# EAGLE schematic ElectroLab (EAGLE 9.5.1)

## Sheet 1 of 4
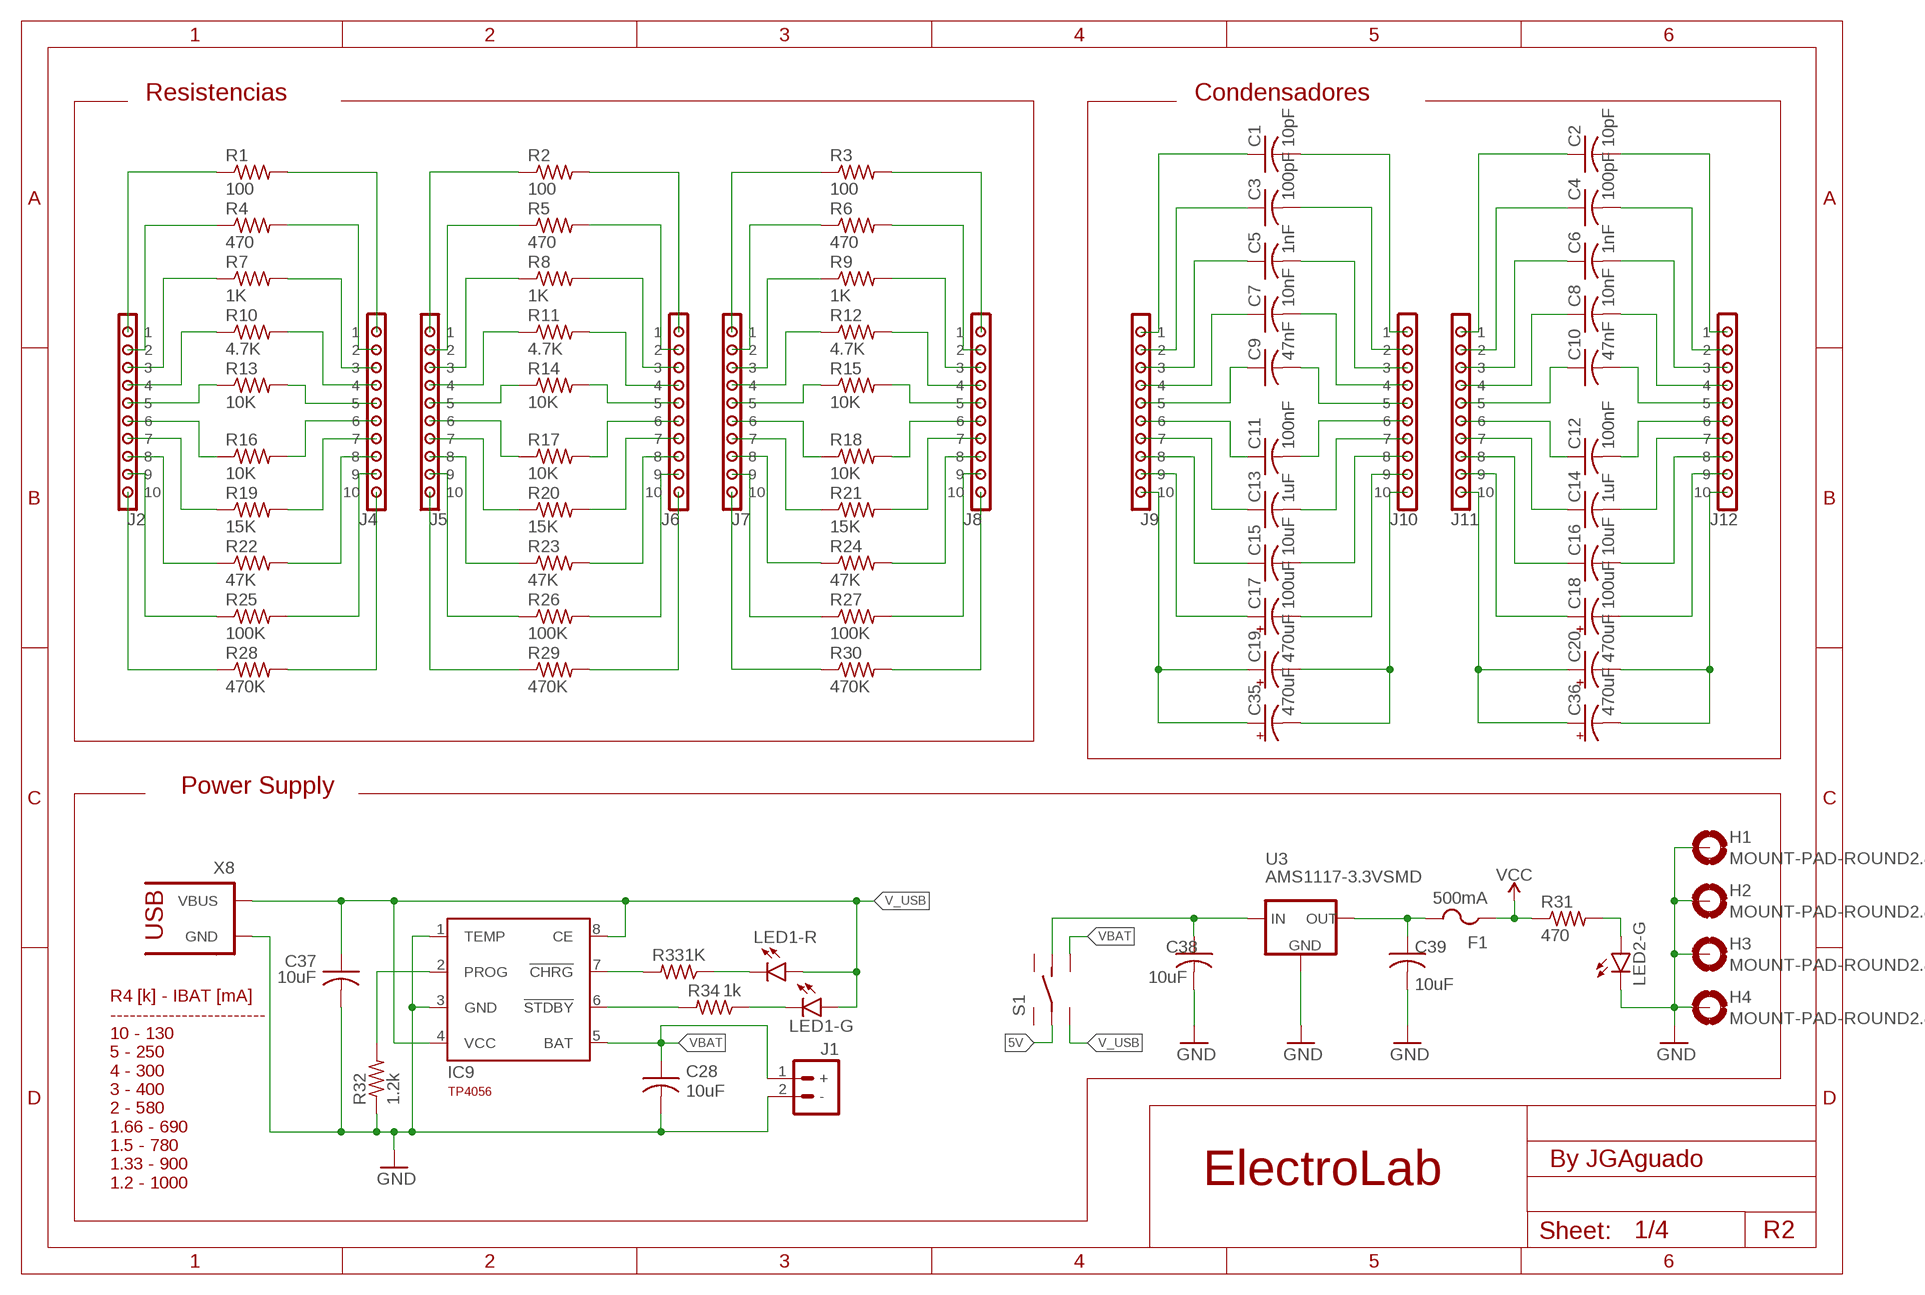
[diagram p0: schematic, sheet 1]

### Parts
C1  10pF  C0603  [0603]
C2  10pF  C0603  [0603]
C3  100pF  C0603  [0603]
C4  100pF  C0603  [0603]
C5  1nF  C0603  [0603]
C6  1nF  C0603  [0603]
C7  10nF  C0603  [0603]
C8  10nF  C0603  [0603]
C9  47nF  C0603  [0603]
C10  47nF  C0603  [0603]
C11  100nF  C0603  [0603]
C12  100nF  C0603  [0603]
C13  1uF  C0603  [0603]
C14  1uF  C0603  [0603]
C15  10uF  C0603  [0603]
C16  10uF  C0603  [0603]
C17  100uF  C3528  [B/3528-21R]
C18  100uF  C3528  [B/3528-21R]
C19  470uF  C7343  [D/7343-31R]
C20  470uF  C7343  [D/7343-31R]
C28  10uF  C-USC0603  [C0603]
C35  470uF  C7343  [D/7343-31R]
C36  470uF  C7343  [D/7343-31R]
C37  10uF  C-USC0603  [C0603]
C38  10uF  C-USC0603  [C0603]
C39  10uF  C-USC0603  [C0603]
F1  500mA  PTCFUSE-1206  [R1206]
H1  MOUNT-PAD-ROUND2.8  [2,8-PAD]
H2  MOUNT-PAD-ROUND2.8  [2,8-PAD]
H3  MOUNT-PAD-ROUND2.8  [2,8-PAD]
H4  MOUNT-PAD-ROUND2.8  [2,8-PAD]
IC9  TP4056  [SOT23-8]
J1  BAT_CONN-JST-2MM-SMT  [JST-2-SMD]
J2  CONN_10"  [1X10]
J4  CONN_10"  [1X10]
J5  CONN_10"  [1X10]
J6  CONN_10"  [1X10]
J7  CONN_10"  [1X10]
J8  CONN_10"  [1X10]
J9  CONN_10"  [1X10]
J10  CONN_10"  [1X10]
J11  CONN_10"  [1X10]
J12  CONN_10"  [1X10]
LED1  E6CC1205RYGC2UDA  RED&GREEN_LED  [BICOLOR_LED]
LED2  E6CC1205RYGC2UDA  RED&GREEN_LED  [BICOLOR_LED]
R1  100  R0603  [0603]
R2  100  R0603  [0603]
R3  100  R0603  [0603]
R4  470  R0603  [0603]
R5  470  R0603  [0603]
R6  470  R0603  [0603]
R7  1K  R0603  [0603]
R8  1K  R0603  [0603]
R9  1K  R0603  [0603]
R10  4.7K  R0603  [0603]
R11  4.7K  R0603  [0603]
R12  4.7K  R0603  [0603]
R13  10K  R0603  [0603]
R14  10K  R0603  [0603]
R15  10K  R0603  [0603]
R16  10K  R0603  [0603]
R17  10K  R0603  [0603]
R18  10K  R0603  [0603]
R19  15K  R0603  [0603]
R20  15K  R0603  [0603]
R21  15K  R0603  [0603]
R22  47K  R0603  [0603]
R23  47K  R0603  [0603]
R24  47K  R0603  [0603]
R25  100K  R0603  [0603]
R26  100K  R0603  [0603]
R27  100K  R0603  [0603]
R28  470K  R0603  [0603]
R29  470K  R0603  [0603]
R30  470K  R0603  [0603]
R31  470  R0603  [0603]
R32  1.2k  R-US_R0603  [R0603]
R33  1K  R0603  [0603]
R34  1k  R0603  [0603]
S1  DPDT_JS202011CQN  [DPDT_JS202011CQN]
U3  AMS1117-3.3VSMD  [SOT223]
X8  USB-C-POWER  [USB-C-POWER]

### Nets
5V: S1.2(LC) ; also sheet 3
GND: C28.2 C37.2 C38.2 C39.2 H1.B2,8(MOUNT) H2.B2,8(MOUNT) H3.B2,8(MOUNT) H4.B2,8(MOUNT) IC9.1(TEMP) IC9.3(GND) J1.2(-) LED2.1(-G:C) R32.1 U3.1(GND) X8.GND ; also sheet 2,3,4
N$1: J2.1 R1.1
N$2: J2.2 R4.1
N$3: J2.3 R7.1
N$4: J2.4 R10.1
N$5: J2.5 R13.1
N$6: J2.6 R16.1
N$7: J2.7 R19.1
N$8: J2.8 R22.1
N$9: J2.9 R25.1
N$10: J2.10 R28.1
N$11: J4.10 R28.2
N$12: J4.9 R25.2
N$13: J4.8 R22.2
N$14: J4.7 R19.2
N$15: J4.5 R13.2
N$16: J4.6 R16.2
N$17: J4.4 R10.2
N$18: J4.3 R7.2
N$19: J4.2 R4.2
N$20: J4.1 R1.2
N$21: J5.1 R2.1
N$22: J5.2 R5.1
N$23: J5.3 R8.1
N$24: J5.4 R11.1
N$25: J5.5 R14.1
N$26: J5.6 R17.1
N$27: J5.7 R20.1
N$28: J5.8 R23.1
N$29: J5.9 R26.1
N$30: J5.10 R29.1
N$31: J6.10 R29.2
N$32: J6.9 R26.2
N$33: J6.8 R23.2
N$34: J6.7 R20.2
N$35: J6.6 R17.2
N$36: J6.5 R14.2
N$37: J6.4 R11.2
N$38: J6.3 R8.2
N$39: J6.2 R5.2
N$40: J6.1 R2.2
N$41: J7.1 R3.1
N$42: J7.2 R6.1
N$43: J7.3 R9.1
N$44: J7.4 R12.1
N$45: J7.5 R15.1
N$46: J7.6 R18.1
N$47: J7.7 R21.1
N$48: J7.8 R24.1
N$49: J7.9 R27.1
N$50: J7.10 R30.1
N$51: J8.10 R30.2
N$52: J8.9 R27.2
N$53: J8.8 R24.2
N$54: J8.7 R21.2
N$55: J8.6 R18.2
N$56: J8.5 R15.2
N$57: J8.4 R12.2
N$58: J8.3 R9.2
N$59: J8.2 R6.2
N$60: J8.1 R3.2
N$61: C1.1 J9.1
N$62: C3.1 J9.2
N$63: C5.1 J9.3
N$64: C7.1 J9.4
N$65: C9.1 J9.5
N$66: C11.1 J9.6
N$67: C13.1 J9.7
N$68: C15.1 J9.8
N$69: C17.+ J9.9
N$70: C19.+ C35.+ J9.10
N$71: C1.2 J10.1
N$72: C3.2 J10.2
N$73: C5.2 J10.3
N$74: C7.2 J10.4
N$75: C9.2 J10.5
N$76: C11.2 J10.6
N$77: C13.2 J10.7
N$78: C15.2 J10.8
N$79: C17.- J10.9
N$80: C19.- C35.- J10.10
N$81: C2.1 J11.1
N$82: C4.1 J11.2
N$83: C6.1 J11.3
N$84: C8.1 J11.4
N$85: C10.1 J11.5
N$86: C12.1 J11.6
N$87: C14.1 J11.7
N$88: C16.1 J11.8
N$89: C18.+ J11.9
N$90: C20.+ C36.+ J11.10
N$91: C20.- C36.- J12.10
N$92: C18.- J12.9
N$93: C16.2 J12.8
N$94: C14.2 J12.7
N$95: C12.2 J12.6
N$96: C10.2 J12.5
N$97: C8.2 J12.4
N$98: C6.2 J12.3
N$99: C4.2 J12.2
N$100: C2.2 J12.1
N$103: LED2.2(-G:A) R31.2
N$104: IC9.6(!STDBY) R34.2
N$105: LED1.4(-R:C) R33.1
N$106: LED1.1(-G:C) R34.1
N$107: IC9.2(PROG) R32.2
N$108: IC9.7(!CHRG) R33.2
N$109: C38.1 S1.5(RC) U3.3(IN)
V_USB: C37.1 IC9.4(VCC) IC9.8(CE) LED1.2(-G:A) LED1.3(-R:A) S1.3(L2) X8.VBUS
VBAT: C28.1 IC9.5(BAT) J1.1(+) S1.6(R2)
VCC: F1.1 R31.1 ; also sheet 2,3,4
VOUT: C39.1 F1.2 U3.2(OUT)
Unconnected: LED2.3(-R:A) LED2.4(-R:C) S1.1(L1) S1.4(R1)

### Notes on the sheet
- Resistencias | Condensadores
- Power Supply
- R4 [k] - IBAT [mA]
  ------------------------
  10 - 130
  5 - 250
  4 - 300
  3 - 400
  2 - 580
  1.66 - 690
  1.5 - 780
  1.33 - 900
  1.2 - 1000
- By JGAguado
- R2

## Sheet 2 of 4
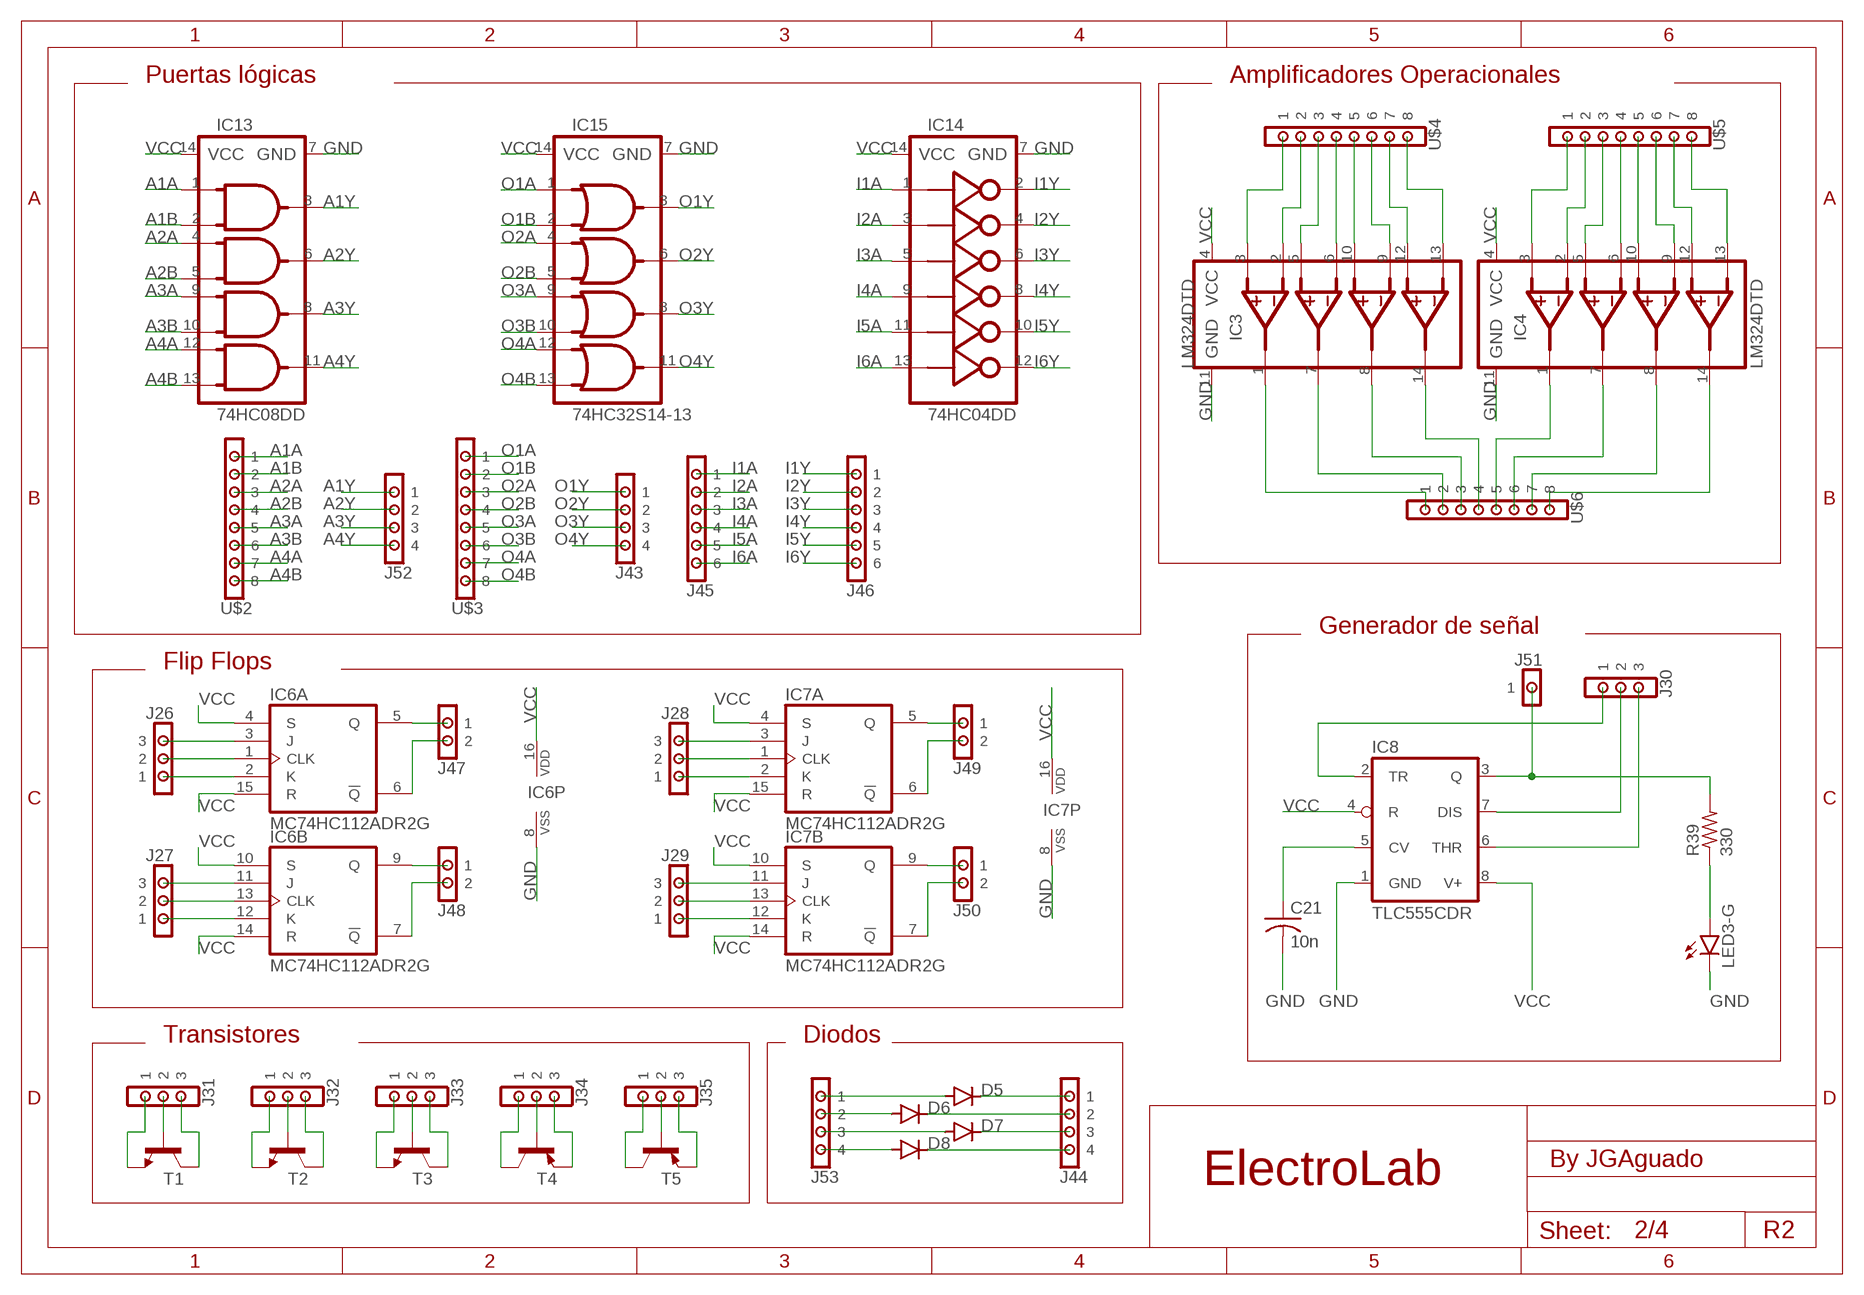
[diagram p1: schematic, sheet 2]

### Parts
C21  10n  C0603  [0603]
D5  LL4148  [LL-34]
D6  LL4148  [LL-34]
D7  LL4148  [LL-34]
D8  LL4148  [LL-34]
IC3  LM324DTD  [SO14]
IC4  LM324DTD  [SO14]
IC6  MC74HC112ADR2G  JK_FLIP_FLOPMC74HC112ADR2G  [SO16]
IC7  MC74HC112ADR2G  JK_FLIP_FLOPMC74HC112ADR2G  [SO16]
IC8  TLC555CDR  NE555D  [SO08]
IC13  74HC08DD  [SO14]
IC14  74HC04DD  [SO14]
IC15  74HC32S14-13  74AHC32D74HC32S14-13  [SO14]
J26  CONN_03  [1X03]
J27  CONN_03  [1X03]
J28  CONN_03  [1X03]
J29  CONN_03  [1X03]
J30  CONN_03  [1X03]
J31  CONN_03  [1X03]
J32  CONN_03  [1X03]
J33  CONN_03  [1X03]
J34  CONN_03  [1X03]
J35  CONN_03  [1X03]
J43  CONN_04  [1X04]
J44  CONN_04  [1X04]
J45  CONN_06  [1X06]
J46  CONN_06  [1X06]
J47  CONN_02  [1X02]
J48  CONN_02  [1X02]
J49  CONN_02  [1X02]
J50  CONN_02  [1X02]
J51  CONN_01  [1X01]
J52  CONN_04  [1X04]
J53  CONN_04  [1X04]
LED3  E6CC1205RYGC2UDA  RED&GREEN_LED  [BICOLOR_LED]
R39  330  R0603  [0603]
T1  MMBT2222A  T_NPNMMBT2222A-1P_CHANGJ_SOT23-BEC  [SOT23]
T2  T_NPNMMBT2222A-1P_CHANGJ_SOT23-BEC  [SOT23]
T3  T_NPNMMBT2222A-1P_CHANGJ_SOT23-BEC  [SOT23]
T4  T_PNPMMBT5401_CHANGJ_SOT23-BEC  [SOT23]
T5  T_PNPMMBT5401_CHANGJ_SOT23-BEC  [SOT23]
U$2  CONN_08  [1X08]
U$3  CONN_08  [1X08]
U$4  CONN_08  [1X08]
U$5  CONN_08  [1X08]
U$6  CONN_08  [1X08]

### Nets
A1A: IC13.1(1A) U$2.1 ; also sheet 4
A1B: IC13.2(1B) U$2.2 ; also sheet 4
A1Y: IC13.3(1Y) J52.1
A2A: IC13.4(2A) U$2.3 ; also sheet 4
A2B: IC13.5(2B) U$2.4 ; also sheet 4
A2Y: IC13.6(2Y) J52.2
A3A: IC13.9(3A) U$2.5 ; also sheet 4
A3B: IC13.10(3B) U$2.6 ; also sheet 4
A3Y: IC13.8(3Y) J52.3
A4A: IC13.12(4A) U$2.7 ; also sheet 4
A4B: IC13.13(4B) U$2.8 ; also sheet 4
A4Y: IC13.11(4Y) J52.4
GND: C21.2 IC3.11(GND) IC4.11(GND) IC6.8(P:VSS) IC7.8(P:VSS) IC8.1(GND) IC13.7(GND) IC14.7(GND) IC15.7(GND) LED3.1(-G:C) ; also sheet 1,3,4
I1A: IC14.1(1A) J45.1 ; also sheet 4
I1Y: IC14.2(1Y) J46.1
I2A: IC14.3(2A) J45.2 ; also sheet 4
I2Y: IC14.4(2Y) J46.2
I3A: IC14.5(3A) J45.3 ; also sheet 4
I3Y: IC14.6(3Y) J46.3
I4A: IC14.9(4A) J45.4 ; also sheet 4
I4Y: IC14.8(4Y) J46.4
I5A: IC14.11(5A) J45.5 ; also sheet 4
I5Y: IC14.10(5Y) J46.5
I6A: IC14.13(6A) J45.6 ; also sheet 4
I6Y: IC14.12(6Y) J46.6
N$101: D8.A J53.4
N$110: D8.C J44.4
N$111: D5.A J53.1
N$112: IC6.5(A:Q) J47.1
N$113: IC6.9(B:Q) J48.1
N$114: IC7.5(A:Q) J49.1
N$115: IC7.9(B:Q) J50.1
N$122: LED3.2(-G:A) R39.1
N$130: IC3.3(1+) U$4.1
N$131: IC3.2(1-) U$4.2
N$132: IC3.5(2+) U$4.3
N$133: IC3.6(2-) U$4.4
N$134: IC3.10(3+) U$4.5
N$135: IC3.9(3-) U$4.6
N$136: IC3.12(4+) U$4.7
N$137: IC3.13(4-) U$4.8
N$138: IC4.3(1+) U$5.1
N$146: IC6.2(A:K) J26.1
N$155: IC6.1(A:CLK) J26.2
N$156: IC6.3(A:J) J26.3
N$157: IC6.12(B:K) J27.1
N$158: IC6.13(B:CLK) J27.2
N$159: IC6.11(B:J) J27.3
N$160: IC7.2(A:K) J28.1
N$161: IC7.1(A:CLK) J28.2
N$162: IC7.3(A:J) J28.3
N$171: IC7.12(B:K) J29.1
N$172: IC7.13(B:CLK) J29.2
N$173: IC7.11(B:J) J29.3
N$178: IC6.6(A:!Q) J47.2
N$179: IC6.7(B:!Q) J48.2
N$180: IC7.6(A:!Q) J49.2
N$181: IC7.7(B:!Q) J50.2
N$183: D7.A J53.3
N$184: D6.A J53.2
N$186: IC4.2(1-) U$5.2
N$187: IC4.5(2+) U$5.3
N$188: IC4.6(2-) U$5.4
N$189: IC4.10(3+) U$5.5
N$190: IC4.9(3-) U$5.6
N$191: IC4.12(4+) U$5.7
N$192: IC4.13(4-) U$5.8
N$193: IC3.1(1Y) U$6.1
N$194: IC3.7(2Y) U$6.2
N$195: IC3.8(3Y) U$6.3
N$196: IC3.14(4Y) U$6.4
N$197: IC4.1(1Y) U$6.5
N$198: IC4.7(2Y) U$6.6
N$199: D5.C J44.1
N$200: IC4.8(3Y) U$6.7
N$201: IC4.14(4Y) U$6.8
N$202: D6.C J44.2
N$203: D7.C J44.3
N$205: J31.1 T1.2(E)
N$206: J31.2 T1.1(B)
N$207: J31.3 T1.3(C)
N$208: J32.1 T2.2(E)
N$209: J32.2 T2.1(B)
N$210: J32.3 T2.3(C)
N$211: J33.1 T3.2(E)
N$212: J33.2 T3.1(B)
N$213: J33.3 T3.3(C)
N$217: J34.1 T4.3(C)
N$218: J34.2 T4.1(B)
N$219: J34.3 T4.2(E)
N$220: J35.1 T5.3(C)
N$221: J35.2 T5.1(B)
N$222: J35.3 T5.2(E)
N$223: IC8.2(TR) J30.1
N$224: IC8.3(Q) J51.1 R39.2
N$225: C21.1 IC8.5(CV)
N$226: IC8.7(DIS) J30.2
N$227: IC8.6(THR) J30.3
O1A: IC15.1(1A) U$3.1 ; also sheet 4
O1B: IC15.2(1B) U$3.2 ; also sheet 4
O1Y: IC15.3(1Y) J43.1
O2A: IC15.4(2A) U$3.3 ; also sheet 4
O2B: IC15.5(2B) U$3.4 ; also sheet 4
O2Y: IC15.6(2Y) J43.2
O3A: IC15.9(3A) U$3.5 ; also sheet 4
O3B: IC15.10(3B) U$3.6 ; also sheet 4
O3Y: IC15.8(3Y) J43.3
O4A: IC15.12(4A) U$3.7 ; also sheet 4
O4B: IC15.13(4B) U$3.8 ; also sheet 4
O4Y: IC15.11(4Y) J43.4
VCC: IC3.4(VCC) IC4.4(VCC) IC6.4(A:S) IC6.10(B:S) IC6.14(B:R) IC6.15(A:R) IC6.16(P:VDD) IC7.4(A:S) IC7.10(B:S) IC7.14(B:R) IC7.15(A:R) IC7.16(P:VDD) IC8.4(R) IC8.8(V+) IC13.14(VCC) IC14.14(VCC) IC15.14(VCC) ; also sheet 1,3,4
Unconnected: LED3.3(-R:A) LED3.4(-R:C)

### Notes on the sheet
- Puertas lógicas | Amplificadores Operacionales
- Generador de señal
- Flip Flops
- Transistores | Diodos
- By JGAguado
- R2

## Sheet 3 of 4
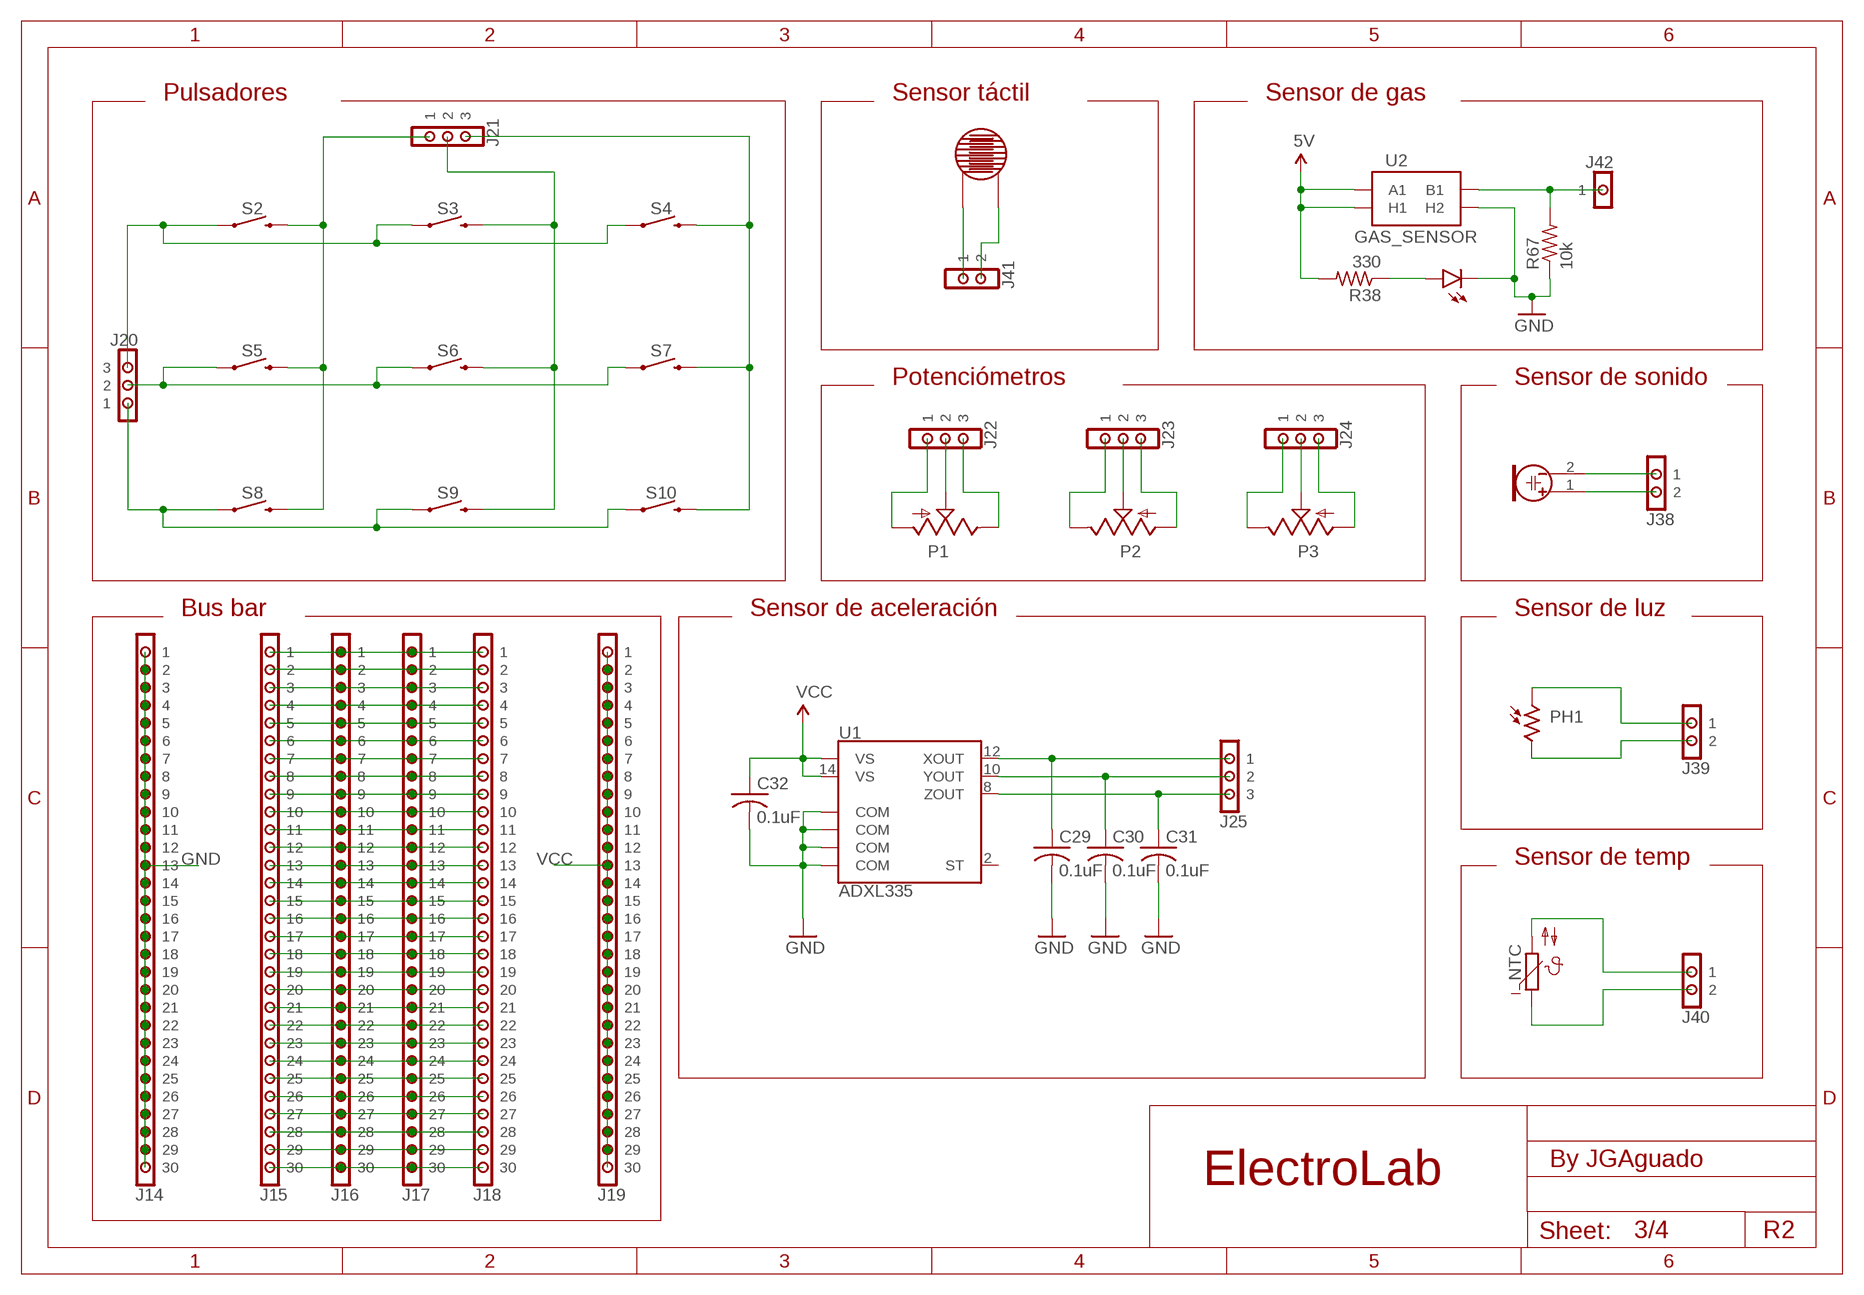
[diagram p2: schematic, sheet 3]

### Parts
C29  0.1uF  C0603  [0603]
C30  0.1uF  C0603  [0603]
C31  0.1uF  C0603  [0603]
C32  0.1uF  C0603  [0603]
J14  CONN_30  [1X30]
J15  CONN_30  [1X30]
J16  CONN_30  [1X30]
J17  CONN_30  [1X30]
J18  CONN_30  [1X30]
J19  CONN_30  [1X30]
J20  CONN_03  [1X03]
J21  CONN_03  [1X03]
J22  CONN_03  [1X03]
J23  CONN_03  [1X03]
J24  CONN_03  [1X03]
J25  CONN_03  [1X03]
J38  CONN_02  [1X02]
J39  CONN_02  [1X02]
J40  CONN_02  [1X02]
J41  CONN_02  [1X02]
J42  CONN_01  [1X01]
LED13  E6CC1205RYGC2UDA  RED&GREEN_LED  [BICOLOR_LED]
MIC  MICROPHONE  [MICROPHONE]
NTC  THERMISTOR  [NTC]
P1  SLIDE_POT_20MM  [RS201111J011]
P2  ALPS_RK09K_VERTICAL  [ALPS_RK09K_VERTICAL]
P3  ALPS_RK09K_VERTICAL  [ALPS_RK09K_VERTICAL]
PH1  PHOTORESISTOR  [GL5516]
R38  330  R0603  [0603]
R67  10k  R0603  [0603]
S2  MOMENTARY-SWITCH-SPST-PTH-6.0MM  [TACTILE_SWITCH_PTH_6.0MM]
S3  MOMENTARY-SWITCH-SPST-PTH-6.0MM  [TACTILE_SWITCH_PTH_6.0MM]
S4  MOMENTARY-SWITCH-SPST-PTH-6.0MM  [TACTILE_SWITCH_PTH_6.0MM]
S5  MOMENTARY-SWITCH-SPST-PTH-6.0MM  [TACTILE_SWITCH_PTH_6.0MM]
S6  MOMENTARY-SWITCH-SPST-PTH-6.0MM  [TACTILE_SWITCH_PTH_6.0MM]
S7  MOMENTARY-SWITCH-SPST-PTH-6.0MM  [TACTILE_SWITCH_PTH_6.0MM]
S8  MOMENTARY-SWITCH-SPST-PTH-6.0MM  [TACTILE_SWITCH_PTH_6.0MM]
S9  MOMENTARY-SWITCH-SPST-PTH-6.0MM  [TACTILE_SWITCH_PTH_6.0MM]
S10  MOMENTARY-SWITCH-SPST-PTH-6.0MM  [TACTILE_SWITCH_PTH_6.0MM]
U1  ADXL335  [LFCSP-16-4X4]
U2  GAS_SENSOR  GAS_SENSORMQ-3  [GAS_SENSOR]
U$16  RESISTIVE_SENSOR_PAD  [RESISTIVE_SENSOR_PAD]

### Nets
5V: R38.2 U2.A1 U2.HA(H1) ; also sheet 1
GND: C29.2 C30.2 C31.2 C32.2 J14.1 J14.2 J14.3 J14.4 J14.5 J14.6 J14.7 J14.8 J14.9 J14.10 J14.11 J14.12 J14.13 J14.14 J14.15 J14.16 J14.17 J14.18 J14.19 J14.20 J14.21 J14.22 J14.23 J14.24 J14.25 J14.26 J14.27 J14.28 J14.29 J14.30 LED13.1(-G:C) R67.1 U1.3(COM) U1.5(COM) U1.6(COM) U1.7(COM) U2.HB(H2) ; also sheet 1,2,4
N$119: J42.1 R67.2 U2.B1
N$120: LED13.2(-G:A) R38.1
N$125: J41.2 U$16.0
N$126: J41.1 U$16.1
N$127: J15.24 J16.24 J17.24 J18.24
N$128: J15.30 J16.30 J17.30 J18.30
N$129: J15.29 J16.29 J17.29 J18.29
N$139: J15.28 J16.28 J17.28 J18.28
N$140: J15.27 J16.27 J17.27 J18.27
N$141: J15.26 J16.26 J17.26 J18.26
N$142: J15.25 J16.25 J17.25 J18.25
N$143: J15.23 J16.23 J17.23 J18.23
N$144: J15.22 J16.22 J17.22 J18.22
N$145: J15.21 J16.21 J17.21 J18.21
N$147: J15.20 J16.20 J17.20 J18.20
N$148: J15.19 J16.19 J17.19 J18.19
N$149: J15.18 J16.18 J17.18 J18.18
N$150: J15.17 J16.17 J17.17 J18.17
N$151: J15.16 J16.16 J17.16 J18.16
N$152: J15.15 J16.15 J17.15 J18.15
N$153: J15.14 J16.14 J17.14 J18.14
N$154: J15.13 J16.13 J17.13 J18.13
N$163: J15.12 J16.12 J17.12 J18.12
N$164: J15.11 J16.11 J17.11 J18.11
N$165: J15.10 J16.10 J17.10 J18.10
N$166: J15.9 J16.9 J17.9 J18.9
N$167: J15.8 J16.8 J17.8 J18.8
N$168: J15.7 J16.7 J17.7 J18.7
N$169: J15.6 J16.6 J17.6 J18.6
N$170: J15.5 J16.5 J17.5 J18.5
N$174: J15.4 J16.4 J17.4 J18.4
N$175: J15.3 J16.3 J17.3 J18.3
N$176: J15.2 J16.2 J17.2 J18.2
N$177: J15.1 J16.1 J17.1 J18.1
N$231: J21.1 S2.3 S5.3 S8.3
N$232: J21.2 S3.3 S6.3 S9.3
N$234: J39.1 PH1.1
N$235: J39.2 PH1.3
N$236: J40.1 NTC.2
N$237: J23.1 P2.3
N$238: J23.2 P2.2
N$239: J23.3 P2.1
N$240: J22.1 P1.3
N$241: J22.2 P1.2
N$242: J22.3 P1.1
N$243: J24.1 P3.3
N$244: J24.2 P3.2
N$245: J24.3 P3.1
N$249: J38.1 MIC.2
N$250: J38.2 MIC.1
N$253: J20.3 S2.1 S3.1 S4.1
N$256: J40.2 NTC.1
N$258: J20.2 S5.1 S6.1 S7.1
N$260: J21.3 S4.3 S7.3 S10.3
N$261: J20.1 S8.1 S9.1 S10.1
VCC: C32.1 J19.1 J19.2 J19.3 J19.4 J19.5 J19.6 J19.7 J19.8 J19.9 J19.10 J19.11 J19.12 J19.13 J19.14 J19.15 J19.16 J19.17 J19.18 J19.19 J19.20 J19.21 J19.22 J19.23 J19.24 J19.25 J19.26 J19.27 J19.28 J19.29 J19.30 U1.14(VS) U1.15(VS) ; also sheet 1,2,4
X+: C29.1 J25.1 U1.12(XOUT)
Y+: C30.1 J25.2 U1.10(YOUT)
Z+: C31.1 J25.3 U1.8(ZOUT)
Unconnected: LED13.3(-R:A) LED13.4(-R:C) U1.2(ST)

### Notes on the sheet
- Pulsadores | Sensor táctil | Sensor de gas
- Potenciómetros | Sensor de sonido
- Bus bar | Sensor de aceleración | Sensor de luz
- Sensor de temp
- By JGAguado
- R2

## Sheet 4 of 4
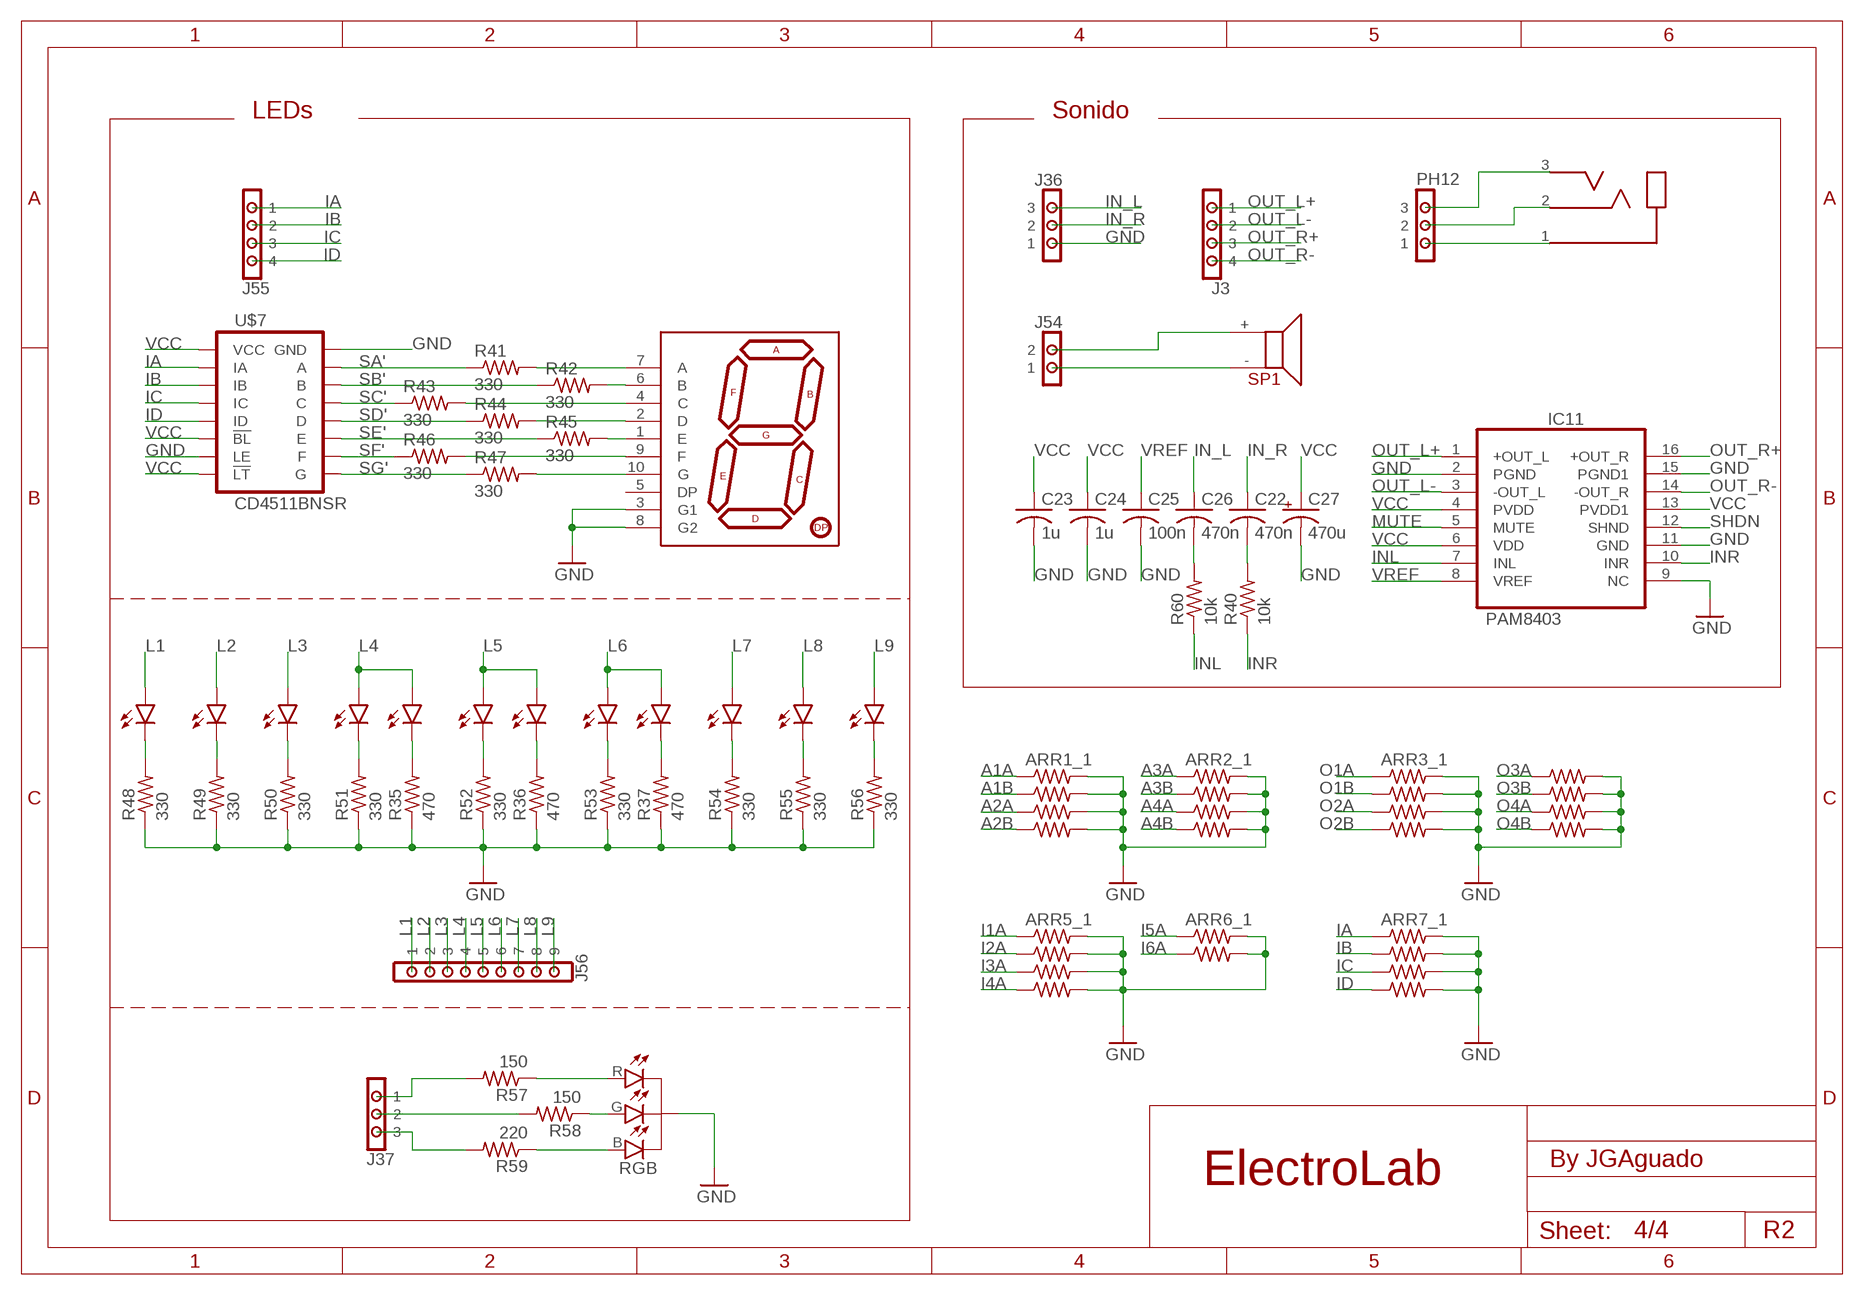
[diagram p3: schematic, sheet 4]

### Parts
ARR1  4_RES_ARRAY_R06031KOHM  [0603-ARC]
ARR2  4_RES_ARRAY_R06031KOHM  [0603-ARC]
ARR3  4_RES_ARRAY_R06031KOHM  [0603-ARC]
ARR4  4_RES_ARRAY_R06031KOHM  [0603-ARC]
ARR5  4_RES_ARRAY_R06031KOHM  [0603-ARC]
ARR6  4_RES_ARRAY_R06031KOHM  [0603-ARC]
ARR7  4_RES_ARRAY_R06031KOHM  [0603-ARC]
C22  470n  C0603  [0603]
C23  1u  C0603  [0603]
C24  1u  C0603  [0603]
C25  100n  C0603  [0603]
C26  470n  C0603  [0603]
C27  470u  C7343  [D/7343-31R]
IC11  PAM8403  [SOP-16]
J3  CONN_04  [1X04]
J36  CONN_03  [1X03]
J37  CONN_03  [1X03]
J54  CONN_02  [1X02]
J55  CONN_04  [1X04]
J56  CONN_09  [1X09]
JACK  AUDIO_JACK_MONO_3.5_3P  [HC-PJ-320A-3P-D]
LED4  E6CC1205RYGC2UDA  RED&GREEN_LED  [BICOLOR_LED]
LED5  E6CC1205RYGC2UDA  RED&GREEN_LED  [BICOLOR_LED]
LED6  E6CC1205RYGC2UDA  RED&GREEN_LED  [BICOLOR_LED]
LED7  E6CC1205RYGC2UDA  RED&GREEN_LED  [BICOLOR_LED]
LED8  E6CC1205RYGC2UDA  RED&GREEN_LED  [BICOLOR_LED]
LED9  E6CC1205RYGC2UDA  RED&GREEN_LED  [BICOLOR_LED]
LED10  E6CC1205RYGC2UDA  RED&GREEN_LED  [BICOLOR_LED]
LED11  E6CC1205RYGC2UDA  RED&GREEN_LED  [BICOLOR_LED]
LED12  E6CC1205RYGC2UDA  RED&GREEN_LED  [BICOLOR_LED]
PH12  CONN_03  [1X03]
R35  470  R0603  [0603]
R36  470  R0603  [0603]
R37  470  R0603  [0603]
R40  10k  R0603  [0603]
R41  330  R0603  [0603]
R42  330  R0603  [0603]
R43  330  R0603  [0603]
R44  330  R0603  [0603]
R45  330  R0603  [0603]
R46  330  R0603  [0603]
R47  330  R0603  [0603]
R48  330  R0603  [0603]
R49  330  R0603  [0603]
R50  330  R0603  [0603]
R51  330  R0603  [0603]
R52  330  R0603  [0603]
R53  330  R0603  [0603]
R54  330  R0603  [0603]
R55  330  R0603  [0603]
R56  330  R0603  [0603]
R57  150  R0603  [0603]
R58  150  R0603  [0603]
R59  220  R0603  [0603]
R60  10k  R0603  [0603]
RGB  CLEAR  LED-RGB-CCCLEAR  [LED-RGB-THRU]
SP1  SPEAKERFS1508MB0810-H8.0  [FS1508MB0810-H8.0]
U$1  FJ5101AG  7-SEGMENT-1DIGIT-GREEN  [7-SEGMENT]
U$7  CD4511BNSR  [SO16]

### Nets
A1A: ARR1.1 ; also sheet 2
A1B: ARR1.2 ; also sheet 2
A2A: ARR1.3 ; also sheet 2
A2B: ARR1.4 ; also sheet 2
A3A: ARR2.1 ; also sheet 2
A3B: ARR2.2 ; also sheet 2
A4A: ARR2.3 ; also sheet 2
A4B: ARR2.4 ; also sheet 2
B: J37.3 R59.2
G: J37.2 R58.2
GND: ARR1.5 ARR1.6 ARR1.7 ARR1.8 ARR2.5 ARR2.6 ARR2.7 ARR2.8 ARR3.5 ARR3.6 ARR3.7 ARR3.8 ARR4.5 ARR4.6 ARR4.7 ARR4.8 ARR5.5 ARR5.6 ARR5.7 ARR5.8 ARR6.7 ARR6.8 ARR7.5 ARR7.6 ARR7.7 ARR7.8 C23.2 C24.2 C25.2 C27.- IC11.2(PGND) IC11.9(NC) IC11.11(GND) IC11.15(PGND1) J36.1 R35.1 R36.1 R37.1 R48.1 R49.1 R50.1 R51.1 R52.1 R53.1 R54.1 R55.1 R56.1 RGB.C U$1.3(G1) U$1.8(G2) U$7.5(LE) U$7.8(GND) ; also sheet 1,2,3
I1A: ARR5.1 ; also sheet 2
I2A: ARR5.2 ; also sheet 2
I3A: ARR5.3 ; also sheet 2
I4A: ARR5.4 ; also sheet 2
I5A: ARR6.1 ; also sheet 2
I6A: ARR6.2 ; also sheet 2
IA: ARR7.1 J55.1 U$7.7(IA)
IB: ARR7.2 J55.2 U$7.1(IB)
IC: ARR7.3 J55.3 U$7.2(IC)
ID: ARR7.4 J55.4 U$7.6(ID)
IN_L: C26.1 J36.3
IN_R: C22.1 J36.2
INL: IC11.7(INL) R60.1
INR: IC11.10(INR) R40.1
L1: J56.1 LED4.2(-G:A)
L2: J56.2 LED5.2(-G:A)
L3: J56.3 LED6.2(-G:A)
L4: J56.4 LED7.2(-G:A) LED7.3(-R:A)
L5: J56.5 LED8.2(-G:A) LED8.3(-R:A)
L6: J56.6 LED9.2(-G:A) LED9.3(-R:A)
L7: J56.7 LED10.3(-R:A)
L8: J56.8 LED11.3(-R:A)
L9: J56.9 LED12.3(-R:A)
MUTE: IC11.5(MUTE)
N$102: JACK.2 PH12.2
N$116: JACK.1 PH12.1
N$117: R58.1 RGB.G
N$118: LED4.1(-G:C) R48.2
N$123: C26.2 R60.2
N$124: C22.2 R40.2
N$182: LED5.1(-G:C) R49.2
N$185: LED6.1(-G:C) R50.2
N$204: LED7.1(-G:C) R51.2
N$214: LED8.1(-G:C) R52.2
N$215: LED9.1(-G:C) R53.2
N$216: LED7.4(-R:C) R35.2
N$246: LED8.4(-R:C) R36.2
N$247: LED9.4(-R:C) R37.2
N$248: LED10.4(-R:C) R54.2
N$251: LED11.4(-R:C) R55.2
N$252: LED12.4(-R:C) R56.2
N$257: J54.2 SP1.+
N$264: JACK.3 PH12.3
N$291: J54.1 SP1.-
N$308: R57.1 RGB.R
N$310: R59.1 RGB.B
O1A: ARR3.1 ; also sheet 2
O1B: ARR3.2 ; also sheet 2
O2A: ARR3.3 ; also sheet 2
O2B: ARR3.4 ; also sheet 2
O3A: ARR4.1 ; also sheet 2
O3B: ARR4.2 ; also sheet 2
O4A: ARR4.3 ; also sheet 2
O4B: ARR4.4 ; also sheet 2
OUT_L+: IC11.1(+OUT_L) J3.1
OUT_L-: IC11.3(-OUT_L) J3.2
OUT_R+: IC11.16(+OUT_R) J3.3
OUT_R-: IC11.14(-OUT_R) J3.4
R: J37.1 R57.2
SA: R41.2 U$1.7(A)
SA': R41.1 U$7.13(A)
SB: R42.2 U$1.6(B)
SB': R42.1 U$7.12(B)
SC: R43.2 U$1.4(C)
SC': R43.1 U$7.11(C)
SD: R44.2 U$1.2(D)
SD': R44.1 U$7.10(D)
SE: R45.2 U$1.1(E)
SE': R45.1 U$7.9(E)
SF: R46.2 U$1.9(F)
SF': R46.1 U$7.15(F)
SG: R47.2 U$1.10(G)
SG': R47.1 U$7.14(G)
SHDN: IC11.12(SHND)
VCC: C23.1 C24.1 C27.+ IC11.4(PVDD) IC11.6(VDD) IC11.13(PVDD1) U$7.3(!LT) U$7.4(!BL) U$7.16(VCC) ; also sheet 1,2,3
VREF: C25.1 IC11.8(VREF)
Unconnected: ARR6.3 ARR6.4 ARR6.5 ARR6.6 LED4.3(-R:A) LED4.4(-R:C) LED5.3(-R:A) LED5.4(-R:C) LED6.3(-R:A) LED6.4(-R:C) LED10.1(-G:C) LED10.2(-G:A) LED11.1(-G:C) LED11.2(-G:A) LED12.1(-G:C) LED12.2(-G:A) U$1.5(DP)

### Notes on the sheet
- LEDs | Sonido
- By JGAguado
- R2

## Library data of the parts
ARR1-ARR7 = SpaceDIY_passive_components:4_RES_ARRAY_R0603; LCSC: C20197
C1-C16 C21-C26 C29-C32 = SpaceDIY_passive_components:C0603
C17 C18 = SpaceDIY_passive_components:C3528; LCSC: C16133
C19 C20 C27 C35 C36 = SpaceDIY_passive_components:C7343; LCSC: C7229
C28 C37-C39 = rcl:C-US: CAPACITOR, American symbol; SPICEPREFIX: C
D5-D8 = SpaceDIY_semiconductors:LL4148: Diode Ultra Fast 100V 0.2A 2SOD-80 Source: Datasheet <https://www.onsemi.com/pub/Collateral/LL4148-D.pdf>; ARROW_PART_NUMBER: LL4148; ARROW_PRICE-STOCK: https://www.arrow.com/en/products/ll4148/on-semiconductor?region=europe; DESCRIPTION: Diode Ultra Fast 100V 0.2A 2SOD-80; HEIGHT: 1mm; LCSC: C9808; MANUFACTURER_NAME: onsemi; MANUFACTURER_PART_NUMBER: LL4148; MOUSER_PART_NUMBER: 512-LL4148; MOUSER_PRICE-STOCK: https://www.mouser.co.uk/ProductDetail/ON-Semiconductor-Fairchild/LL4148?qs=z%2Fr5wmDnQfY5jXgsdLPkRg%3D%3D
F1 = adafruit:PTCFUSE: PTC fuses, resettable thermistors; LCSC: C355568
H1-H4 = holes:MOUNT-PAD-ROUND: MOUNTING PAD, round
IC3 IC4 = SpaceDIY_IC:LM324DT: Operational Amplfier; LCSC: C71035
IC6 IC7 = SpaceDIY_IC:JK_FLIP_FLOP: Dual JK FLIP FLOP; LCSC: C233600
IC8 = adafruit:*555: TIMER Changed DIP package to have round (not oval) pin pads http://www.ladyada.net/library/pcb/eaglelibrary.html; LCSC: C6986
IC9 = TP4056:TP4056: TP4056 Data sheet <http://goo.gl/J7k8TF> Dave.Calaway Eagle Library <https://goo.gl/Muy1Tr>; LCSC: C16581
IC11 = PAM8403:PAM8403: Dual channel audio amplifier IC - PAM8403
IC13 = SpaceDIY_IC:74HC08D: Logic Gates AND; LCSC: C5593
IC14 = SpaceDIY_IC:74HC04D: Hex INVERTER; LCSC: C5590
IC15 = SpaceDIY_IC:74AHC32D: Logic Gates OR; LCSC: C176921
J1 = SpaceDIY_connectors:BAT_CONN: Multi connection point. Often used as Generic Header-pin footprint for 0.1 inch spaced/style header connections On any of the 0.1 inch spaced packages, you can populate with these: Break Away Headers - Straight <https://www.sparkfun.com/products/116> (PRT-00116) Break Away Male Headers - Right Angle <https://www.sparkfun.com/products/553> (PRT-00553) Female Headers <https://www.sparkfun.com/products/115> (PRT-00115) Break Away Headers - Machine Pin <https://www.sparkfun.com/products/117> (PRT-00117) Break Away Female Headers - Swiss Machine Pin <https://www.sparkfun.com/products/743> (PRT-00743) For SCREWTERMINALS and SPRING TERMINALS visit here: Screw Terimnals on SparkFun.com <https://www.sparkfun.com/search/results?term=Screw+Terminals> (5mm/3.5mm/2.54mm spacing) This device is also useful as a general connection point to wire up your design to another part of your project. Our various solder wires solder well into these plated through hole pads. Hook-Up Wire - Assortment (Stranded, 22 AWG) <https://www.sparkfun.com/products/11375> (PRT-11375) Hook-Up Wire - Assortment (Solid Core, 22 AWG) <https://www.sparkfun.com/products/11367> (PRT-11367) View the entire wire category on our website here <https://www.sparkfun.com/categories/141> Special notes: Molex polarized connector foot print use with: PRT-08233 with associated crimp pins and housings. 2.54_SCREWTERM for use with PRT-10571. 3.5mm Screw Terminal footprints for PRT-08084 5mm Screw Terminal footprints for use with PRT-08432; LCSC: C3029440
J2 J4-J12 = SpaceDIY_connectors:CONN_10: Multi connection point. Often used as Generic Header-pin footprint for 0.1 inch spaced/style header connections On any of the 0.1 inch spaced packages, you can populate with these: Break Away Headers - Straight <https://www.sparkfun.com/products/116> (PRT-00116) Break Away Male Headers - Right Angle <https://www.sparkfun.com/products/553> (PRT-00553) Female Headers <https://www.sparkfun.com/products/115> (PRT-00115) Break Away Headers - Machine Pin <https://www.sparkfun.com/products/117> (PRT-00117) Break Away Female Headers - Swiss Machine Pin <https://www.sparkfun.com/products/743> (PRT-00743) Arduino Stackable Header - 10 Pin <https://www.sparkfun.com/products/11376> (PRT-11376) For SCREWTERMINALS and SPRING TERMINALS visit here: Screw Terimnals on SparkFun.com <https://www.sparkfun.com/search/results?term=Screw+Terminals> (5mm/3.5mm/2.54mm spacing) This device is also useful as a general connection point to wire up your design to another part of your project. Our various solder wires solder well into these plated through hole pads. Hook-Up Wire - Assortment (Stranded, 22 AWG) <https://www.sparkfun.com/products/11375> (PRT-11375) Hook-Up Wire - Assortment (Solid Core, 22 AWG) <https://www.sparkfun.com/products/11367> (PRT-11367) View the entire wire category on our website here <https://www.sparkfun.com/categories/141> Special notes: Molex polarized connector foot print use with SKU : PRT-08231 with associated crimp pins and housings. 1MM SMD Version SKU: PRT-10208 NOTES ON THE VARIANTS LOCK and LOCK_LONGPADS... This footprint was designed to help hold the alignment of a through-hole component (i.e. 6-pin header) while soldering it into place. You may notice that each hole has been shifted either up or down by 0.005 of an inch from it's more standard position (which is a perfectly straight line). This slight alteration caused the pins (the squares in the middle) to touch the edges of the holes. Because they are alternating, it causes a "brace" to hold the component in place. 0.005 has proven to be the perfect amount of "off-center" position when using our standard breakaway headers. Although looks a little odd when you look at the bare footprint, once you have a header in there, the alteration is very hard to notice. Also,if you push a header all the way into place, it is covered up entirely on the bottom side.; PROD_ID: CONN-11563
J3 J43 J44 J52 J53 J55 = SpaceDIY_connectors:CONN_04: Multi connection point. Often used as Generic Header-pin footprint for 0.1 inch spaced/style header connections On any of the 0.1 inch spaced packages, you can populate with these: Break Away Headers - Straight <https://www.sparkfun.com/products/116> (PRT-00116) Break Away Male Headers - Right Angle <https://www.sparkfun.com/products/553> (PRT-00553) Female Headers <https://www.sparkfun.com/products/115> (PRT-00115) Break Away Headers - Machine Pin <https://www.sparkfun.com/products/117> (PRT-00117) Break Away Female Headers - Swiss Machine Pin <https://www.sparkfun.com/products/743> (PRT-00743) Arduino Stackable Header - 10 Pin <https://www.sparkfun.com/products/11376> (PRT-11376) For SCREWTERMINALS and SPRING TERMINALS visit here: Screw Terimnals on SparkFun.com <https://www.sparkfun.com/search/results?term=Screw+Terminals> (5mm/3.5mm/2.54mm spacing) This device is also useful as a general connection point to wire up your design to another part of your project. Our various solder wires solder well into these plated through hole pads. Hook-Up Wire - Assortment (Stranded, 22 AWG) <https://www.sparkfun.com/products/11375> (PRT-11375) Hook-Up Wire - Assortment (Solid Core, 22 AWG) <https://www.sparkfun.com/products/11367> (PRT-11367) View the entire wire category on our website here <https://www.sparkfun.com/categories/141> Special notes: Molex polarized connector foot print use with SKU : PRT-08231 with associated crimp pins and housings. 1MM SMD Version SKU: PRT-10208 NOTES ON THE VARIANTS LOCK and LOCK_LONGPADS... This footprint was designed to help hold the alignment of a through-hole component (i.e. 6-pin header) while soldering it into place. You may notice that each hole has been shifted either up or down by 0.005 of an inch from it's more standard position (which is a perfectly straight line). This slight alteration caused the pins (the squares in the middle) to touch the edges of the holes. Because they are alternating, it causes a "brace" to hold the component in place. 0.005 has proven to be the perfect amount of "off-center" position when using our standard breakaway headers. Although looks a little odd when you look at the bare footprint, once you have a header in there, the alteration is very hard to notice. Also,if you push a header all the way into place, it is covered up entirely on the bottom side.
J14-J19 = SpaceDIY_connectors:CONN_30: Multi connection point. Often used as Generic Header-pin footprint for 0.1 inch spaced/style header connections On any of the 0.1 inch spaced packages, you can populate with these: Break Away Headers - Straight <https://www.sparkfun.com/products/116> (PRT-00116) Break Away Male Headers - Right Angle <https://www.sparkfun.com/products/553> (PRT-00553) Female Headers <https://www.sparkfun.com/products/115> (PRT-00115) Break Away Headers - Machine Pin <https://www.sparkfun.com/products/117> (PRT-00117) Break Away Female Headers - Swiss Machine Pin <https://www.sparkfun.com/products/743> (PRT-00743) Arduino Stackable Header - 10 Pin <https://www.sparkfun.com/products/11376> (PRT-11376) For SCREWTERMINALS and SPRING TERMINALS visit here: Screw Terimnals on SparkFun.com <https://www.sparkfun.com/search/results?term=Screw+Terminals> (5mm/3.5mm/2.54mm spacing) This device is also useful as a general connection point to wire up your design to another part of your project. Our various solder wires solder well into these plated through hole pads. Hook-Up Wire - Assortment (Stranded, 22 AWG) <https://www.sparkfun.com/products/11375> (PRT-11375) Hook-Up Wire - Assortment (Solid Core, 22 AWG) <https://www.sparkfun.com/products/11367> (PRT-11367) View the entire wire category on our website here <https://www.sparkfun.com/categories/141> Special notes: Molex polarized connector foot print use with SKU : PRT-08231 with associated crimp pins and housings. 1MM SMD Version SKU: PRT-10208 NOTES ON THE VARIANTS LOCK and LOCK_LONGPADS... This footprint was designed to help hold the alignment of a through-hole component (i.e. 6-pin header) while soldering it into place. You may notice that each hole has been shifted either up or down by 0.005 of an inch from it's more standard position (which is a perfectly straight line). This slight alteration caused the pins (the squares in the middle) to touch the edges of the holes. Because they are alternating, it causes a "brace" to hold the component in place. 0.005 has proven to be the perfect amount of "off-center" position when using our standard breakaway headers. Although looks a little odd when you look at the bare footprint, once you have a header in there, the alteration is very hard to notice. Also,if you push a header all the way into place, it is covered up entirely on the bottom side.
J20-J37 PH12 = SpaceDIY_connectors:CONN_03: Multi connection point. Often used as Generic Header-pin footprint for 0.1 inch spaced/style header connections On any of the 0.1 inch spaced packages, you can populate with these: Break Away Headers - Straight <https://www.sparkfun.com/products/116> (PRT-00116) Break Away Male Headers - Right Angle <https://www.sparkfun.com/products/553> (PRT-00553) Female Headers <https://www.sparkfun.com/products/115> (PRT-00115) Break Away Headers - Machine Pin <https://www.sparkfun.com/products/117> (PRT-00117) Break Away Female Headers - Swiss Machine Pin <https://www.sparkfun.com/products/743> (PRT-00743) Arduino Stackable Header - 10 Pin <https://www.sparkfun.com/products/11376> (PRT-11376) For SCREWTERMINALS and SPRING TERMINALS visit here: Screw Terimnals on SparkFun.com <https://www.sparkfun.com/search/results?term=Screw+Terminals> (5mm/3.5mm/2.54mm spacing) This device is also useful as a general connection point to wire up your design to another part of your project. Our various solder wires solder well into these plated through hole pads. Hook-Up Wire - Assortment (Stranded, 22 AWG) <https://www.sparkfun.com/products/11375> (PRT-11375) Hook-Up Wire - Assortment (Solid Core, 22 AWG) <https://www.sparkfun.com/products/11367> (PRT-11367) View the entire wire category on our website here <https://www.sparkfun.com/categories/141> Special notes: Molex polarized connector foot print use with SKU : PRT-08231 with associated crimp pins and housings. 1MM SMD Version SKU: PRT-10208 NOTES ON THE VARIANTS LOCK and LOCK_LONGPADS... This footprint was designed to help hold the alignment of a through-hole component (i.e. 6-pin header) while soldering it into place. You may notice that each hole has been shifted either up or down by 0.005 of an inch from it's more standard position (which is a perfectly straight line). This slight alteration caused the pins (the squares in the middle) to touch the edges of the holes. Because they are alternating, it causes a "brace" to hold the component in place. 0.005 has proven to be the perfect amount of "off-center" position when using our standard breakaway headers. Although looks a little odd when you look at the bare footprint, once you have a header in there, the alteration is very hard to notice. Also,if you push a header all the way into place, it is covered up entirely on the bottom side.
J38-J41 J47-J50 J54 = SpaceDIY_connectors:CONN_02: Multi connection point. Often used as Generic Header-pin footprint for 0.1 inch spaced/style header connections On any of the 0.1 inch spaced packages, you can populate with these: Break Away Headers - Straight <https://www.sparkfun.com/products/116> (PRT-00116) Break Away Male Headers - Right Angle <https://www.sparkfun.com/products/553> (PRT-00553) Female Headers <https://www.sparkfun.com/products/115> (PRT-00115) Break Away Headers - Machine Pin <https://www.sparkfun.com/products/117> (PRT-00117) Break Away Female Headers - Swiss Machine Pin <https://www.sparkfun.com/products/743> (PRT-00743) Arduino Stackable Header - 10 Pin <https://www.sparkfun.com/products/11376> (PRT-11376) For SCREWTERMINALS and SPRING TERMINALS visit here: Screw Terimnals on SparkFun.com <https://www.sparkfun.com/search/results?term=Screw+Terminals> (5mm/3.5mm/2.54mm spacing) This device is also useful as a general connection point to wire up your design to another part of your project. Our various solder wires solder well into these plated through hole pads. Hook-Up Wire - Assortment (Stranded, 22 AWG) <https://www.sparkfun.com/products/11375> (PRT-11375) Hook-Up Wire - Assortment (Solid Core, 22 AWG) <https://www.sparkfun.com/products/11367> (PRT-11367) View the entire wire category on our website here <https://www.sparkfun.com/categories/141> Special notes: Molex polarized connector foot print use with SKU : PRT-08231 with associated crimp pins and housings. 1MM SMD Version SKU: PRT-10208 NOTES ON THE VARIANTS LOCK and LOCK_LONGPADS... This footprint was designed to help hold the alignment of a through-hole component (i.e. 6-pin header) while soldering it into place. You may notice that each hole has been shifted either up or down by 0.005 of an inch from it's more standard position (which is a perfectly straight line). This slight alteration caused the pins (the squares in the middle) to touch the edges of the holes. Because they are alternating, it causes a "brace" to hold the component in place. 0.005 has proven to be the perfect amount of "off-center" position when using our standard breakaway headers. Although looks a little odd when you look at the bare footprint, once you have a header in there, the alteration is very hard to notice. Also,if you push a header all the way into place, it is covered up entirely on the bottom side.
J42 J51 = SpaceDIY_connectors:CONN_01: Multi connection point. Often used as Generic Header-pin footprint for 0.1 inch spaced/style header connections On any of the 0.1 inch spaced packages, you can populate with these: Break Away Headers - Straight <https://www.sparkfun.com/products/116> (PRT-00116) Break Away Male Headers - Right Angle <https://www.sparkfun.com/products/553> (PRT-00553) Female Headers <https://www.sparkfun.com/products/115> (PRT-00115) Break Away Headers - Machine Pin <https://www.sparkfun.com/products/117> (PRT-00117) Break Away Female Headers - Swiss Machine Pin <https://www.sparkfun.com/products/743> (PRT-00743) Arduino Stackable Header - 10 Pin <https://www.sparkfun.com/products/11376> (PRT-11376) For SCREWTERMINALS and SPRING TERMINALS visit here: Screw Terimnals on SparkFun.com <https://www.sparkfun.com/search/results?term=Screw+Terminals> (5mm/3.5mm/2.54mm spacing) This device is also useful as a general connection point to wire up your design to another part of your project. Our various solder wires solder well into these plated through hole pads. Hook-Up Wire - Assortment (Stranded, 22 AWG) <https://www.sparkfun.com/products/11375> (PRT-11375) Hook-Up Wire - Assortment (Solid Core, 22 AWG) <https://www.sparkfun.com/products/11367> (PRT-11367) View the entire wire category on our website here <https://www.sparkfun.com/categories/141> Special notes: Molex polarized connector foot print use with SKU : PRT-08231 with associated crimp pins and housings. 1MM SMD Version SKU: PRT-10208 NOTES ON THE VARIANTS LOCK and LOCK_LONGPADS... This footprint was designed to help hold the alignment of a through-hole component (i.e. 6-pin header) while soldering it into place. You may notice that each hole has been shifted either up or down by 0.005 of an inch from it's more standard position (which is a perfectly straight line). This slight alteration caused the pins (the squares in the middle) to touch the edges of the holes. Because they are alternating, it causes a "brace" to hold the component in place. 0.005 has proven to be the perfect amount of "off-center" position when using our standard breakaway headers. Although looks a little odd when you look at the bare footprint, once you have a header in there, the alteration is very hard to notice. Also,if you push a header all the way into place, it is covered up entirely on the bottom side.
J45 J46 = SpaceDIY_connectors:CONN_06: Multi connection point. Often used as Generic Header-pin footprint for 0.1 inch spaced/style header connections On any of the 0.1 inch spaced packages, you can populate with these: Break Away Headers - Straight <https://www.sparkfun.com/products/116> (PRT-00116) Break Away Male Headers - Right Angle <https://www.sparkfun.com/products/553> (PRT-00553) Female Headers <https://www.sparkfun.com/products/115> (PRT-00115) Break Away Headers - Machine Pin <https://www.sparkfun.com/products/117> (PRT-00117) Break Away Female Headers - Swiss Machine Pin <https://www.sparkfun.com/products/743> (PRT-00743) Arduino Stackable Header - 10 Pin <https://www.sparkfun.com/products/11376> (PRT-11376) For SCREWTERMINALS and SPRING TERMINALS visit here: Screw Terimnals on SparkFun.com <https://www.sparkfun.com/search/results?term=Screw+Terminals> (5mm/3.5mm/2.54mm spacing) This device is also useful as a general connection point to wire up your design to another part of your project. Our various solder wires solder well into these plated through hole pads. Hook-Up Wire - Assortment (Stranded, 22 AWG) <https://www.sparkfun.com/products/11375> (PRT-11375) Hook-Up Wire - Assortment (Solid Core, 22 AWG) <https://www.sparkfun.com/products/11367> (PRT-11367) View the entire wire category on our website here <https://www.sparkfun.com/categories/141> Special notes: Molex polarized connector foot print use with SKU : PRT-08231 with associated crimp pins and housings. 1MM SMD Version SKU: PRT-10208 NOTES ON THE VARIANTS LOCK and LOCK_LONGPADS... This footprint was designed to help hold the alignment of a through-hole component (i.e. 6-pin header) while soldering it into place. You may notice that each hole has been shifted either up or down by 0.005 of an inch from it's more standard position (which is a perfectly straight line). This slight alteration caused the pins (the squares in the middle) to touch the edges of the holes. Because they are alternating, it causes a "brace" to hold the component in place. 0.005 has proven to be the perfect amount of "off-center" position when using our standard breakaway headers. Although looks a little odd when you look at the bare footprint, once you have a header in there, the alteration is very hard to notice. Also,if you push a header all the way into place, it is covered up entirely on the bottom side.
J56 = SpaceDIY_connectors:CONN_09: Multi connection point. Often used as Generic Header-pin footprint for 0.1 inch spaced/style header connections On any of the 0.1 inch spaced packages, you can populate with these: Break Away Headers - Straight <https://www.sparkfun.com/products/116> (PRT-00116) Break Away Male Headers - Right Angle <https://www.sparkfun.com/products/553> (PRT-00553) Female Headers <https://www.sparkfun.com/products/115> (PRT-00115) Break Away Headers - Machine Pin <https://www.sparkfun.com/products/117> (PRT-00117) Break Away Female Headers - Swiss Machine Pin <https://www.sparkfun.com/products/743> (PRT-00743) Arduino Stackable Header - 10 Pin <https://www.sparkfun.com/products/11376> (PRT-11376) For SCREWTERMINALS and SPRING TERMINALS visit here: Screw Terimnals on SparkFun.com <https://www.sparkfun.com/search/results?term=Screw+Terminals> (5mm/3.5mm/2.54mm spacing) This device is also useful as a general connection point to wire up your design to another part of your project. Our various solder wires solder well into these plated through hole pads. Hook-Up Wire - Assortment (Stranded, 22 AWG) <https://www.sparkfun.com/products/11375> (PRT-11375) Hook-Up Wire - Assortment (Solid Core, 22 AWG) <https://www.sparkfun.com/products/11367> (PRT-11367) View the entire wire category on our website here <https://www.sparkfun.com/categories/141> Special notes: Molex polarized connector foot print use with SKU : PRT-08231 with associated crimp pins and housings. 1MM SMD Version SKU: PRT-10208 NOTES ON THE VARIANTS LOCK and LOCK_LONGPADS... This footprint was designed to help hold the alignment of a through-hole component (i.e. 6-pin header) while soldering it into place. You may notice that each hole has been shifted either up or down by 0.005 of an inch from it's more standard position (which is a perfectly straight line). This slight alteration caused the pins (the squares in the middle) to touch the edges of the holes. Because they are alternating, it causes a "brace" to hold the component in place. 0.005 has proven to be the perfect amount of "off-center" position when using our standard breakaway headers. Although looks a little odd when you look at the bare footprint, once you have a header in there, the alteration is very hard to notice. Also,if you push a header all the way into place, it is covered up entirely on the bottom side.
JACK = SpaceDIY_connectors:AUDIO_JACK_MONO_3.5_3P; LCSC: C5372850
LED1-LED13 = SpaceDIY_semiconductors:RED&GREEN_LED: LED (Red & Green color) Counterpost Red, General Green/Yellow-Green SMD,1.3x3.2mm Light Emitting Diodes (LED) ROHS.; LCSC: C2802680
MIC = SpaceDIY_sensors:MICROPHONE: Electret Condenser Microphone; LCSC: C233953
NTC = SpaceDIY_sensors:THERMISTOR: NTC Thermoresistor; LCSC: C13879
P1 = SpaceDIY_electromechanical:SLIDE_POT_20MM: Alps Alpine RS201111J011 ±20% 100mW 10kΩ Plugin Variable Resistors/Potentiometers ROHS; LCSC: C255504
P2 P3 = audio-pots:ALPS_RK09K_VERTICAL
PH1 = SpaceDIY_sensors:PHOTORESISTOR: Photo Sensor element GL5516 Series Source: https://www.lcsc.com/product-detail/Photoresistors_Senba-Sensing-Tech-GL5516_C125626.html
R1-R31 R33-R60 R67 = SpaceDIY_passive_components:R0603
R32 = rcl:R-US_: RESISTOR, American symbol; SPICEPREFIX: R
RGB = SpaceDIY_semiconductors:LED-RGB-CC: LED-RGB Common Cathode; LCSC: C2837021; PROD_ID: TJ-L5FCMXHMCSLCRGB-A5
S1 = SpaceDIY_electromechanical:DPDT: Dual Position, Dual Throw (DPDT) Switch; LCSC: C189615
S2-S10 = SparkFun-Switches:MOMENTARY-SWITCH-SPST: Momentary Switch (Pushbutton) - SPST Normally-open (NO) SPST momentary switches (buttons, pushbuttons). Variants PTH-12MM - 12mm square, through-hole Momentary Pushbutton Switch - 12mm Square <https://www.sparkfun.com/products/9190> (COM-09190) PTH-6.0MM, PTH-6.0MM-KIT - 6.0mm square, through-hole Mini Pushbutton Switch <https://www.sparkfun.com/products/97> (COM-00097) KIT package intended for soldering kit's - only one side of pads' copper is exposed. PTH-RIGHT-ANGLE-KIT - Right-angle, through-hole Right Angle Tactile Button <https://www.sparkfun.com/products/10791> - Used on SparkFun BigTime Watch Kit <https://www.sparkfun.com/products/11734> SMD-12MM - 12mm square, surface-mount Tactile Button - SMD (12mm) <https://www.sparkfun.com/products/12993> (COM-12993) Used on SparkFun PicoBoard <https://www.sparkfun.com/products/11888> SMD-4.5MM - 4.5mm Square Trackball Switch Used on SparkFun Blackberry Trackballer Breakout <https://www.sparkfun.com/products/13169> SMD-4.6MMX2.8MM - 4.60mm x 2.80mm, surface mount Used on SparkFun Pro Micro - RP2040 <https://www.sparkfun.com/products/17717> SMD-5.2MM, SMD-5.2-REDUNDANT - 5.2mm square, surface-mount Mini Pushbutton Switch - SMD <https://www.sparkfun.com/products/8720> (COM-08720) Used on Arduino Pro Mini <https://www.sparkfun.com/products/11114> REDUNDANT package connects both switch circuits together SMD-6.0X3.5MM - 6.0 x 3.5mm, surface mount Momentary Reset Switch SMD <https://www.sparkfun.com/products/8229> (COM-08229) SMD-6.2MM-TALL - 6.2mm square, surface mount Tactile Button - SMD (6mm) <https://www.sparkfun.com/products/12992> Used on SparkFun Digital Sandbox <https://www.sparkfun.com/products/12651> SMD-RIGHT-ANGLE - Right-angle, surface mount Used on SparkFun Block for Intel® Edison - Arduino <https://www.sparkfun.com/products/13036>; PROD_ID: SWCH-08441; SF_SKU: COM-00097
SP1 = SpaceDIY_electromechanical:SPEAKER; LCSC: C969972; MANUFACTURER: FUET; OHM: 8
T1-T3 = SpaceDIY_semiconductors:T_NPN: Transistor NPN; LCSC_DATASHEET: https://datasheet.lcsc.com/lcsc/1811081957_Changjiang-Electronics-Tech--CJ-MMBT2222A-1P_C8512.pdf; LCSC_PART: C8512; LCSC_PRICE1_EUR: 0.023149606; LCSC_ROTATION_CCW: 180; PROPERTIES: 0.3W NPN 0.6A 40V SOT-23(SOT-23-3) Bipolar Transistors - BJT ROHS
T4 T5 = SpaceDIY_semiconductors:T_PNP: Transistor PNP; LCSC_DATASHEET: https://datasheet.lcsc.com/lcsc/1809140241_Changjiang-Electronics-Tech--CJ-MMBT5401_C8326.pdf; LCSC_PART: C8326; LCSC_PRICE1_EUR: 0.020629921; LCSC_ROTATION_CCW: 180; PROPERTIES: 0.3W PNP 0.6A 150V SOT-23(SOT-23-3) Bipolar Transistors - BJT ROHS
U1 = SparkFun-Sensors:ADXL335: Analog Devices ADXL335 3-Axis Analog Accelerometer The ADXL335 is a small, thin, low power, complete 3-axis accelerometer with signal conditioned voltage outputs. The product measures acceleration with a minimum full-scale range of ±3 g. It can measure the static acceleration of gravity in tiltsensing applications, as well as dynamic acceleration resulting from motion, shock, or vibration. Datasheet <https://www.sparkfun.com/datasheets/Components/SMD/adxl335.pdf> SparkFun Products SparkFun Triple Axis Accelerometer Breakout - ADXL335 <https://www.sparkfun.com/products/9269> (SEN-09269) Triple Axis Accelerometer - ADXL335 <https://www.sparkfun.com/products/9265> (SEN-09265); LCSC: C34439; PROD_ID: IC-08942; SF_ID: COM-09265
U2 = SpaceDIY_sensors:GAS_SENSOR: Gas Sensors Through-hole gas sensors with a heating coil and an analog output.; GAS: Alcohol
U3 = SpaceDIY_IC:AMS1117-: Voltage Regulator Standard LM317 adjustable voltage regulator. AOI (Adjust Output Input). Google 'LM317 Calculator' for easy to use app to get the two resistor values needed. 240/720 for 5V output. 240/390 for 3.3V output. Spark Fun Electronics SKU : COM-00527; LCSC: C6186
U$1 = SpaceDIY_semiconductors:7-SEGMENT-1DIGIT: 7-Segment Display, single digit LCSC <https://www.lcsc.com/product-detail/Led-Segment-Display_Shenzhen-Zhihao-Elec-FJ5101AG_C156236.htmlf>; LCSC: C156236
U$2-U$6 = SpaceDIY_connectors:CONN_08: Multi connection point. Often used as Generic Header-pin footprint for 0.1 inch spaced/style header connections On any of the 0.1 inch spaced packages, you can populate with these: Break Away Headers - Straight <https://www.sparkfun.com/products/116> (PRT-00116) Break Away Male Headers - Right Angle <https://www.sparkfun.com/products/553> (PRT-00553) Female Headers <https://www.sparkfun.com/products/115> (PRT-00115) Break Away Headers - Machine Pin <https://www.sparkfun.com/products/117> (PRT-00117) Break Away Female Headers - Swiss Machine Pin <https://www.sparkfun.com/products/743> (PRT-00743) Arduino Stackable Header - 10 Pin <https://www.sparkfun.com/products/11376> (PRT-11376) For SCREWTERMINALS and SPRING TERMINALS visit here: Screw Terimnals on SparkFun.com <https://www.sparkfun.com/search/results?term=Screw+Terminals> (5mm/3.5mm/2.54mm spacing) This device is also useful as a general connection point to wire up your design to another part of your project. Our various solder wires solder well into these plated through hole pads. Hook-Up Wire - Assortment (Stranded, 22 AWG) <https://www.sparkfun.com/products/11375> (PRT-11375) Hook-Up Wire - Assortment (Solid Core, 22 AWG) <https://www.sparkfun.com/products/11367> (PRT-11367) View the entire wire category on our website here <https://www.sparkfun.com/categories/141> Special notes: Molex polarized connector foot print use with SKU : PRT-08231 with associated crimp pins and housings. 1MM SMD Version SKU: PRT-10208 NOTES ON THE VARIANTS LOCK and LOCK_LONGPADS... This footprint was designed to help hold the alignment of a through-hole component (i.e. 6-pin header) while soldering it into place. You may notice that each hole has been shifted either up or down by 0.005 of an inch from it's more standard position (which is a perfectly straight line). This slight alteration caused the pins (the squares in the middle) to touch the edges of the holes. Because they are alternating, it causes a "brace" to hold the component in place. 0.005 has proven to be the perfect amount of "off-center" position when using our standard breakaway headers. Although looks a little odd when you look at the bare footprint, once you have a header in there, the alteration is very hard to notice. Also,if you push a header all the way into place, it is covered up entirely on the bottom side.
U$7 = SpaceDIY_IC:CD4511BNSR: SO-16-208mil Signal Switches / Encoders & Decoders / Multiplexers ROHS; LCSC: C2653686
U$16 = SpaceDIY_sensors:RESISTIVE_SENSOR_PAD
X8 = SpaceDIY_connectors:USB-C-POWER: TYPE-C-31-M-33; LCSC: C2848624